# EAGLE board keyboard (EAGLE 9.6.1)
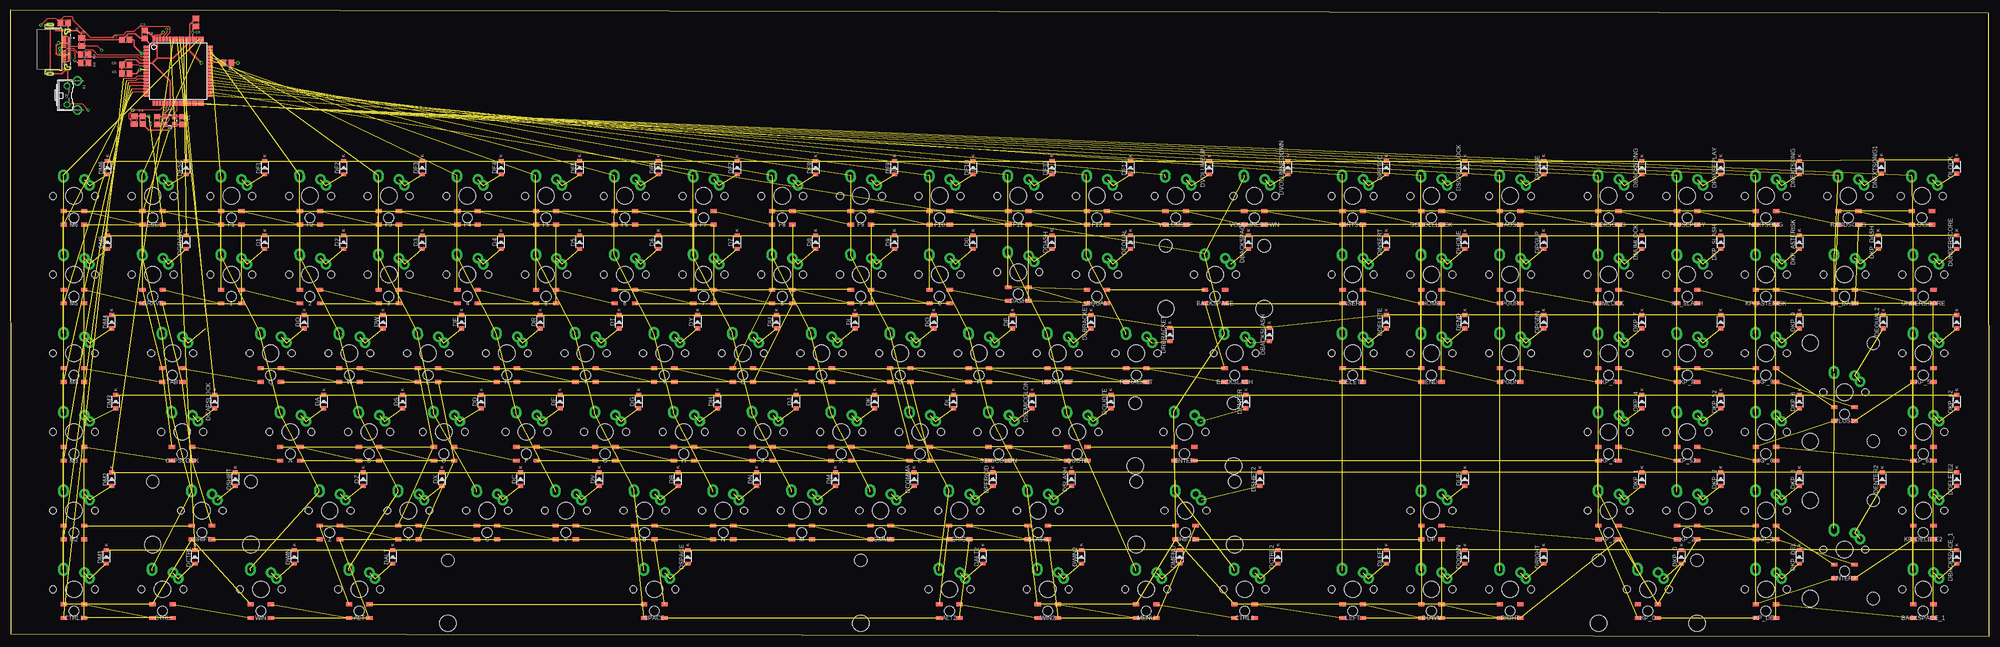
[diagram p6: board, top side]
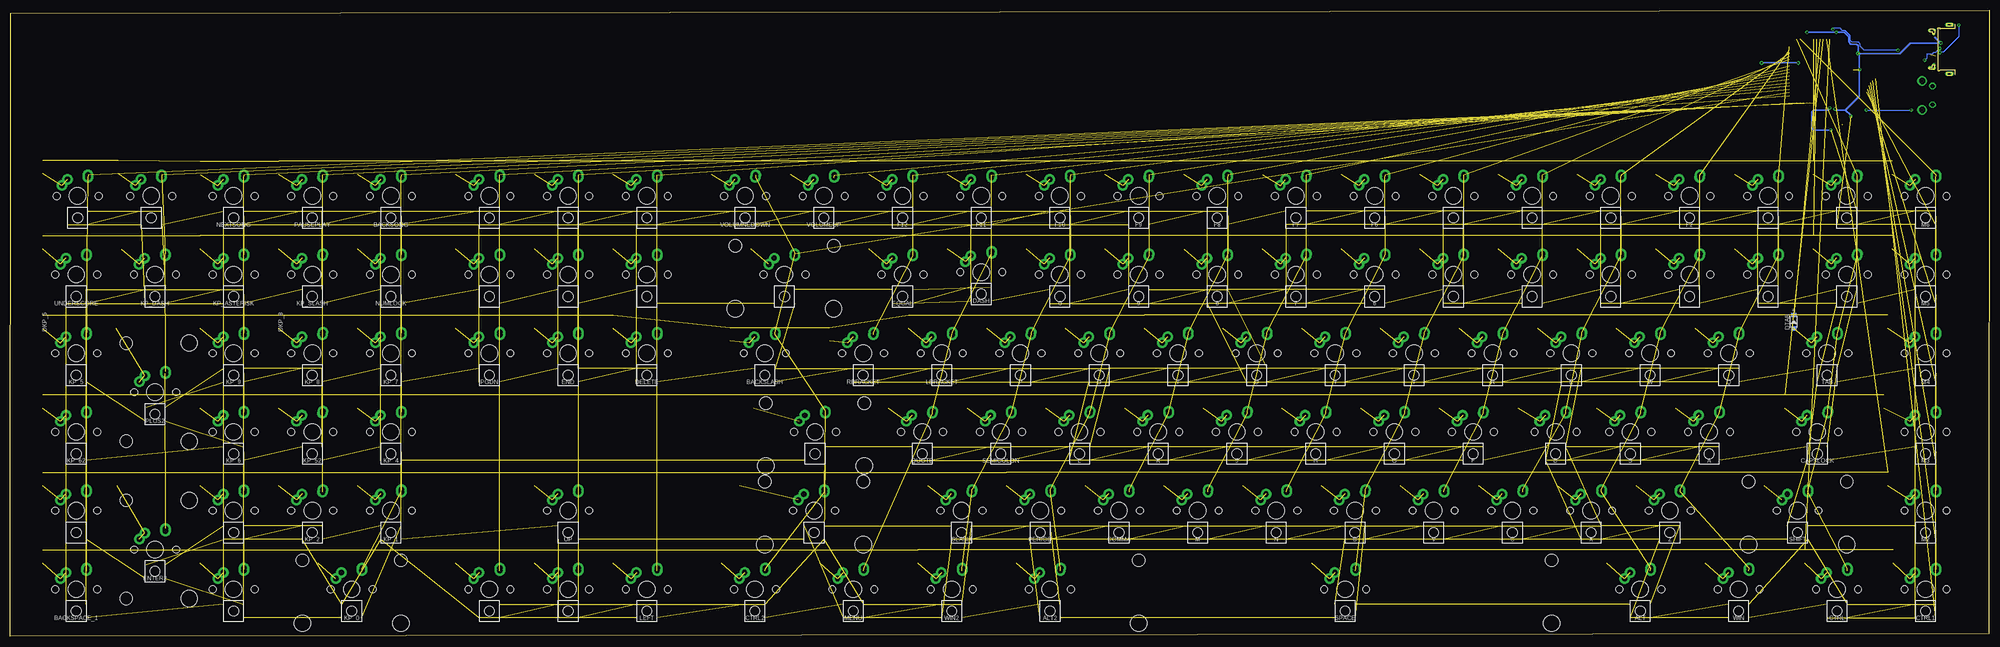
[diagram p7: board, bottom side, seen from below]

Size 479.03 x 151.66 mm. Coordinates in mm from the lower left corner, seen from the top.
Outline: 0.05,0.7 479.03,0 478.98,150.96 0,151.66 0.05,0.7
Copper layers (1+2*15+16): Top 0.035mm / dielectric 1.5mm / Route2 0.035mm / dielectric 0.15mm / Route15 0.035mm / dielectric 0.2mm / Bottom 0.035mm
Design rules "default *": minimum track width 6mil, minimum drill 0.35mm, track to track 6mil, track to pad 6mil, pad to pad 6mil, via to via 6mil, smd to smd 6mil, copper to edge 40mil, drill to drill 6mil, minimum pad ring 10mil, minimum via ring 8mil, stop-mask expansion 4mil, vias tented up to drill 0mil, thermal gap 10mil
Net classes: 0 default: width 0.2 mm; 1 POWER: width 0.406 mm

## Footprints (pad centres in the part's own frame; a part is rotated, then mirrored left to right if it is on the bottom)
ALPSMX-1U-SMDRGB = drill 1.3 pad 2.54: ALPS1 2.5,4; ALPS2 -2.5,4.5; MX1 3.81,2.54; MX2 -2.54,5.08 | smd 1.5 x 0.9: DIN -2.45,-6.95; DOUT 2.45,-3.65; VDD 2.45,-6.95; VSS -2.45,-3.65 | hole 4: 0,0 | hole 1.7: -5.08,0; 5.08,0 | hole 2.4: 0,-5.3
ALPSMX-2U-SMDRGB = drill 1.3 pad 2.54: ALPS1 2.5,4; ALPS2 -2.5,4.5; MX1 3.81,2.54; MX2 -2.54,5.08 | smd 1.5 x 0.9: DIN -2.45,-6.95; DOUT 2.45,-3.65; VDD 2.45,-6.95; VSS -2.45,-3.65 | hole 4: 0,0; -11.9,-8.24; 11.9,-8.24 | hole 1.7: -5.08,0; 5.08,0 | hole 3.05: -11.9,7; 11.9,7 | hole 2.4: 0,-5.3
C0805 = smd 1.3 x 1.5: 1 -0.95,0; 2 0.95,0
SOD-123 = smd 0.91 x 1.22: A -1.635,0; C 1.635,0
ALPSMX-2U-SMDRGB-ROTATED = drill 1.3 pad 2.54: ALPS1 2.5,4; ALPS2 -2.5,4.5; MX1 3.81,2.54; MX2 -2.54,5.08 | smd 1.5 x 0.9: DIN -2.45,-6.95; DOUT 2.45,-3.65; VDD 2.45,-6.95; VSS -2.45,-3.65 | hole 4: 0,0; -8.24,-11.9; -8.24,11.9 | hole 1.7: -5.08,0; 5.08,0 | hole 3.05: 7,-11.9; 7,11.9 | hole 2.4: 0,-5.3
TQFP64 = smd 1.194 x 0.559: 1 -7.76,5.905; 2 -7.76,5.118; 3 -7.76,4.331; 4 -7.76,3.543; 5 -7.76,2.756; 6 -7.76,1.968; 7 -7.76,1.181; 8 -7.76,0.394; 9 -7.76,-0.394; 10 -7.76,-1.181; 11 -7.76,-1.968; 12 -7.76,-2.756; 13 -7.76,-3.543; 14 -7.76,-4.331; 15 -7.76,-5.118; 16 -7.76,-5.905; 33 7.76,-5.905; 34 7.76,-5.118; 35 7.76,-4.331; 36 7.76,-3.543; 37 7.76,-2.756; 38 7.76,-1.968; 39 7.76,-1.181; 40 7.76,-0.394; 41 7.76,0.394; 42 7.76,1.181; 43 7.76,1.968; 44 7.76,2.756; 45 7.76,3.543; 46 7.76,4.331; 47 7.76,5.118; 48 7.76,5.905 | smd 0.559 x 1.194: 17 -5.905,-7.76; 18 -5.118,-7.76; 19 -4.331,-7.76; 20 -3.543,-7.76; 21 -2.756,-7.76; 22 -1.968,-7.76; 23 -1.181,-7.76; 24 -0.394,-7.76; 25 0.394,-7.76; 26 1.181,-7.76; 27 1.968,-7.76; 28 2.756,-7.76; 29 3.543,-7.76; 30 4.331,-7.76; 31 5.118,-7.76; 32 5.905,-7.76; 49 5.905,7.76; 50 5.118,7.76; 51 4.331,7.76; 52 3.543,7.76; 53 2.756,7.76; 54 1.968,7.76; 55 1.181,7.76; 56 0.394,7.76; 57 -0.394,7.76; 58 -1.181,7.76; 59 -1.968,7.76; 60 -2.756,7.76; 61 -3.543,7.76; 62 -4.331,7.76; 63 -5.118,7.76; 64 -5.905,7.76
TE_1-2295018-2 = smd 0.3 x 0.8: A1 -2.75,4.63; A2 -2.25,4.63; A3 -1.75,4.63; A4 -1.25,4.63; A5 -0.75,4.63; A6 -0.25,4.63; A7 0.25,4.63; A8 0.75,4.63; A9 1.25,4.63; A10 1.75,4.63; A11 2.25,4.63; A12 2.75,4.63; B1 3,3.43; B2 2.5,3.43; B3 2,3.43; B4 1.5,3.43; B5 1,3.43; B6 0.5,3.43; B7 -0.5,3.43; B8 -1,3.43; B9 -1.5,3.43; B10 -2,3.43; B11 -2.5,3.43; B12 -3,3.43 | drill 0.5 long: P1_1 -4.55,4.22; P2_1 4.55,4.22 | drill 0.35 long: P1_2 -4.191,3.795; P2_2 4.191,3.795 | drill 0.5 pad 1.1 long: P4 -5.97,0; P5 5.97,0
M0805 = smd 1.3 x 1.6: 1 -0.95,0; 2 0.95,0
B3F-31XX = drill 1.016 octagon: 1 -2.261,-1.245; 2 2.261,-1.245 | drill 1.499 pad 2.159: 3 -3.505,1.245; 4 3.505,1.245
ALPSMX-6.25U-SMDRGB = drill 1.3 pad 2.54: ALPS1 2.5,4; ALPS2 -2.5,4.5; MX1 3.81,2.54; MX2 -2.54,5.08 | smd 1.5 x 0.9: DIN -2.45,-6.95; DOUT 2.45,-3.65; VDD 2.45,-6.95; VSS -2.45,-3.65 | hole 4: 0,0; -50,-8.24; 50,-8.24 | hole 1.7: -5.08,0; 5.08,0 | hole 3.05: -50,7; 50,7 | hole 2.4: 0,-5.3
CRYSTAL-SMD-3.2X2.5MM = smd 1.2 x 1.1: 1 -1.175,-0.875; 2 1.175,-0.875; 3 1.175,0.875; 4 -1.175,0.875

## Placement (x,y rotation side)
0  KEYSWITCH-RGBSMDLED-ALPSMX-1U-SMDRGB  [ALPSMX-1U-SMDRGB]  224.95,87.65 0 top
1  KEYSWITCH-RGBSMDLED-ALPSMX-1U-SMDRGB  [ALPSMX-1U-SMDRGB]  53.5,87.65 0 top
2  KEYSWITCH-RGBSMDLED-ALPSMX-1U-SMDRGB  [ALPSMX-1U-SMDRGB]  72.55,87.65 0 top
3  KEYSWITCH-RGBSMDLED-ALPSMX-1U-SMDRGB  [ALPSMX-1U-SMDRGB]  91.6,87.65 0 top
4  KEYSWITCH-RGBSMDLED-ALPSMX-1U-SMDRGB  [ALPSMX-1U-SMDRGB]  110.65,87.65 0 top
5  KEYSWITCH-RGBSMDLED-ALPSMX-1U-SMDRGB  [ALPSMX-1U-SMDRGB]  129.7,87.65 0 top
6  KEYSWITCH-RGBSMDLED-ALPSMX-1U-SMDRGB  [ALPSMX-1U-SMDRGB]  148.75,87.65 0 top
7  KEYSWITCH-RGBSMDLED-ALPSMX-1U-SMDRGB  [ALPSMX-1U-SMDRGB]  167.8,87.65 0 top
8  KEYSWITCH-RGBSMDLED-ALPSMX-1U-SMDRGB  [ALPSMX-1U-SMDRGB]  186.85,87.65 0 top
9  KEYSWITCH-RGBSMDLED-ALPSMX-1U-SMDRGB  [ALPSMX-1U-SMDRGB]  205.9,87.65 0 top
A  KEYSWITCH-RGBSMDLED-ALPSMX-1U-SMDRGB  [ALPSMX-1U-SMDRGB]  67.79,49.55 0 top
ALT  KEYSWITCH-RGBSMDLED-ALPSMX-1U-SMDRGB  [ALPSMX-1U-SMDRGB]  84.46,11.45 0 top
ALT2  KEYSWITCH-RGBSMDLED-ALPSMX-1U-SMDRGB  [ALPSMX-1U-SMDRGB]  227.33,11.45 0 top
B  KEYSWITCH-RGBSMDLED-ALPSMX-1U-SMDRGB  [ALPSMX-1U-SMDRGB]  153.51,30.5 0 top
BACKSLASH  KEYSWITCH-RGBSMDLED-ALPSMX-1U-SMDRGB  [ALPSMX-1U-SMDRGB]  296.39,68.6 0 top
BACKSONG  KEYSWITCH-RGBSMDLED-ALPSMX-1U-SMDRGB  [ALPSMX-1U-SMDRGB]  386.88,106.7 0 top
BACKSPACE  KEYSWITCH-RGBSMDLED-ALPSMX-2U-SMDRGB  [ALPSMX-2U-SMDRGB]  291.63,87.65 0 top
BACKSPACE_1  KEYSWITCH-RGBSMDLED-ALPSMX-1U-SMDRGB  [ALPSMX-1U-SMDRGB]  463.08,11.45 0 top
C  KEYSWITCH-RGBSMDLED-ALPSMX-1U-SMDRGB  [ALPSMX-1U-SMDRGB]  115.41,30.5 0 top
C1  22pF  [C0805]  41.65,124.95 270 top
C2  22pF  [C0805]  35.55,124.95 90 top
C3  0.1uF  [C0805]  32.51,145.81 270 top
C4  0.1uF  [C0805]  32.02,125.06 270 top
C5  0.1uF  [C0805]  27.93,136.36 180 top
C6  0.1uF  [C0805]  44.93,148.73 90 top
C7  0.1uF  [C0805]  27.93,144.51 180 top
C8  1u  [C0805]  27.93,138.42 0 top
CAPSLOCK  KEYSWITCH-RGBSMDLED-ALPSMX-1U-SMDRGB  [ALPSMX-1U-SMDRGB]  41.59,49.55 0 top
COMMA  KEYSWITCH-RGBSMDLED-ALPSMX-1U-SMDRGB  [ALPSMX-1U-SMDRGB]  210.66,30.5 0 top
CTRL  KEYSWITCH-RGBSMDLED-ALPSMX-1U-SMDRGB  [ALPSMX-1U-SMDRGB]  36.83,11.45 0 top
CTRL1  KEYSWITCH-RGBSMDLED-ALPSMX-1U-SMDRGB  [ALPSMX-1U-SMDRGB]  15.4,11.45 0 top
CTRL2  KEYSWITCH-RGBSMDLED-ALPSMX-1U-SMDRGB  [ALPSMX-1U-SMDRGB]  298.77,11.45 0 top
D  KEYSWITCH-RGBSMDLED-ALPSMX-1U-SMDRGB  [ALPSMX-1U-SMDRGB]  104.97,49.55 0 top
D0  [SOD-123]  233.06,95.5 90 top
D1  [SOD-123]  61.61,95.5 90 top
D2  [SOD-123]  80.66,95.5 90 top
D3  [SOD-123]  99.71,95.5 90 top
D4  [SOD-123]  118.76,95.5 90 top
D5  [SOD-123]  137.81,95.5 90 top
D6  [SOD-123]  156.86,95.5 90 top
D7  [SOD-123]  175.91,95.5 90 top
D8  [SOD-123]  194.96,95.5 90 top
D9  [SOD-123]  214.01,95.5 90 top
DA  [SOD-123]  75.9,56.9 90 top
DALT  [SOD-123]  92.57,19.3 90 top
DALT2  [SOD-123]  235.44,19.3 90 top
DASH  KEYSWITCH-RGBSMDLED-ALPSMX-1U-SMDRGB  [ALPSMX-1U-SMDRGB]  244,88.25 0 top
DB  [SOD-123]  161.62,38.1 90 top
DBACKSLASH  [SOD-123]  304.76,73.15 90 top
DBACKSONG  [SOD-123]  394.99,113.54 90 top
DBACKSPACE  [SOD-123]  299.74,95.5 90 top
DBACKSPACE_1  [SOD-123]  471.19,19.3 90 top
DC  [SOD-123]  123.52,38.1 90 top
DCAPSLOCK  [SOD-123]  49.45,56.9 90 top
DCOMMA  [SOD-123]  218.77,38.1 90 top
DCTRL  [SOD-123]  44.69,19.3 90 top
DCTRL2  [SOD-123]  306.88,19.3 90 top
DD  [SOD-123]  114,56.9 90 top
DDASH  [SOD-123]  252.11,95.5 90 top
DDELETE  [SOD-123]  333.07,76.2 90 top
DDELETE2  [SOD-123]  471.19,38.1 90 top
DDOWN  [SOD-123]  352.12,19.3 90 top
DE  [SOD-123]  109.24,76.2 90 top
DELETE  KEYSWITCH-RGBSMDLED-ALPSMX-1U-SMDRGB  [ALPSMX-1U-SMDRGB]  324.96,68.6 0 top
DEND  [SOD-123]  352.12,76.2 90 top
DENTER  [SOD-123]  299.13,56.9 90 top
DENTER2  [SOD-123]  453.16,38.1 90 top
DEQUAL  [SOD-123]  271.16,95.5 90 top
DEQUAL2  [SOD-123]  453.41,76.2 90 top
DESC  [SOD-123]  42.56,113.54 90 top
DF  [SOD-123]  133.05,56.9 90 top
DF1  [SOD-123]  61.61,113.54 90 top
DF2  [SOD-123]  80.66,113.54 90 top
DF3  [SOD-123]  99.71,113.54 90 top
DF4  [SOD-123]  118.76,113.54 90 top
DF5  [SOD-123]  137.81,113.54 90 top
DF6  [SOD-123]  156.86,113.54 90 top
DF7  [SOD-123]  175.91,113.54 90 top
DF8  [SOD-123]  194.96,113.54 90 top
DF9  [SOD-123]  214.01,113.54 90 top
DF10  [SOD-123]  233.06,113.54 90 top
DF11  [SOD-123]  252.11,113.54 90 top
DF12  [SOD-123]  271.16,113.54 90 top
DG  [SOD-123]  152.1,56.9 90 top
DGRAVE  [SOD-123]  42.56,95.5 90 top
DH  [SOD-123]  171.15,56.9 90 top
DHOME  [SOD-123]  352.12,95.5 90 top
DI  [SOD-123]  204.49,76.2 90 top
DINSERT  [SOD-123]  333.07,95.5 90 top
DJ  [SOD-123]  190.2,56.9 90 top
DK  [SOD-123]  209.25,56.9 90 top
DKP_0  [SOD-123]  404.51,19.3 90 top
DKP_1  [SOD-123]  394.99,38.1 90 top
DKP_2  [SOD-123]  414.04,38.1 90 top
DKP_3  [SOD-123]  433.09,38.1 90 top
DKP_4  [SOD-123]  394.99,56.9 90 top
DKP_5  [SOD-123]  471.19,76.2 90 top
DKP_6  [SOD-123]  433.09,56.9 90 top
DKP_7  [SOD-123]  394.99,76.2 90 top
DKP_8  [SOD-123]  414.04,76.2 90 top
DKP_9  [SOD-123]  433.09,76.2 90 top
DKP_52  [SOD-123]  414.04,56.9 90 top
DKP_62  [SOD-123]  471.19,56.9 90 top
DKP_ASTERISK  [SOD-123]  433.09,95.5 90 top
DKP_DASH  [SOD-123]  452.14,95.5 90 top
DKP_DEL  [SOD-123]  433.09,19.3 90 top
DKP_SLASH  [SOD-123]  414.04,95.5 90 top
DL  [SOD-123]  228.3,56.9 90 top
DLBRACKET  [SOD-123]  261.64,76.2 90 top
DLEFT  [SOD-123]  333.07,19.3 90 top
DLOCK  [SOD-123]  471.19,113.75 90 top
DM  [SOD-123]  199.72,38.1 90 top
DM1  [SOD-123]  23.26,19.3 90 top
DM2  [SOD-123]  24.51,38.1 90 top
DM3  [SOD-123]  25.51,56.9 90 top
DM4  [SOD-123]  24.51,76.2 90 top
DM5  [SOD-123]  23.51,95.5 90 top
DM6  [SOD-123]  23.51,113.54 90 top
DMENU  [SOD-123]  283.07,19.3 90 top
DN  [SOD-123]  180.67,38.1 90 top
DNEXTSONG  [SOD-123]  433.09,113.54 90 top
DNEXTSONG1  [SOD-123]  452.93,113.75 90 top
DNUMLOCK  [SOD-123]  394.99,95.5 90 top
DO  [SOD-123]  223.54,76.2 90 top
DOWN  KEYSWITCH-RGBSMDLED-ALPSMX-1U-SMDRGB  [ALPSMX-1U-SMDRGB]  344.01,11.45 0 top
DP  [SOD-123]  242.59,76.2 90 top
DPAUSE  [SOD-123]  371.17,113.54 90 top
DPAUSEPLAY  [SOD-123]  414.04,113.54 90 top
DPERIOD  [SOD-123]  237.82,38.1 90 top
DPGDN  [SOD-123]  371.17,76.2 90 top
DPGUP  [SOD-123]  371.17,95.5 90 top
DPRTSC  [SOD-123]  333.07,113.54 90 top
DQ  [SOD-123]  71.14,76.2 90 top
DQUOTE  [SOD-123]  266.4,56.9 90 top
DR  [SOD-123]  128.29,76.2 90 top
DRBRACKET  [SOD-123]  280.69,73.15 90 top
DRIGHT  [SOD-123]  371.17,19.3 90 top
DS  [SOD-123]  94.95,56.9 90 top
DSCROLLLOCK  [SOD-123]  352.12,113.54 90 top
DSEMICOLON  [SOD-123]  247.35,56.9 90 top
DSHIFT  [SOD-123]  54.47,38.1 90 top
DSHIFT2  [SOD-123]  302.5,38.1 90 top
DSLASH  [SOD-123]  256.87,38.1 90 top
DSPACE  [SOD-123]  164,19.3 90 top
DT  [SOD-123]  147.34,76.2 90 top
DTAB  [SOD-123]  47.32,76.2 90 bottom
DU  [SOD-123]  185.44,76.2 90 top
DUNDERSCORE  [SOD-123]  471.19,95.5 90 top
DUP  [SOD-123]  352.12,38.1 90 top
DV  [SOD-123]  142.57,38.1 90 top
DVOLUMEUP  [SOD-123]  290.21,113.54 90 top
DVOLUMNEDOWN  [SOD-123]  309.26,113.54 90 top
DW  [SOD-123]  90.19,76.2 90 top
DWIN  [SOD-123]  68.75,19.3 90 top
DWIN2  [SOD-123]  259.25,19.3 90 top
DX  [SOD-123]  104.47,38.1 90 top
DY  [SOD-123]  166.39,76.2 90 top
DZ  [SOD-123]  85.42,38.1 90 top
E  KEYSWITCH-RGBSMDLED-ALPSMX-1U-SMDRGB  [ALPSMX-1U-SMDRGB]  101.13,68.6 0 top
END  KEYSWITCH-RGBSMDLED-ALPSMX-1U-SMDRGB  [ALPSMX-1U-SMDRGB]  344.01,68.6 0 top
ENTER  KEYSWITCH-RGBSMDLED-ALPSMX-2U-SMDRGB  [ALPSMX-2U-SMDRGB]  284.23,49.55 0 top
ENTER2  KEYSWITCH-RGBSMDLED-ALPSMX-2U-SMDRGB-ROTATED  [ALPSMX-2U-SMDRGB-ROTATED]  443.99,21.07 0 top
EQUAL  KEYSWITCH-RGBSMDLED-ALPSMX-1U-SMDRGB  [ALPSMX-1U-SMDRGB]  263.05,87.65 0 top
ESC  KEYSWITCH-RGBSMDLED-ALPSMX-1U-SMDRGB  [ALPSMX-1U-SMDRGB]  34.45,106.7 0 top
F  KEYSWITCH-RGBSMDLED-ALPSMX-1U-SMDRGB  [ALPSMX-1U-SMDRGB]  124.94,49.55 0 top
F1  KEYSWITCH-RGBSMDLED-ALPSMX-1U-SMDRGB  [ALPSMX-1U-SMDRGB]  53.5,106.7 0 top
F2  KEYSWITCH-RGBSMDLED-ALPSMX-1U-SMDRGB  [ALPSMX-1U-SMDRGB]  72.55,106.7 0 top
F3  KEYSWITCH-RGBSMDLED-ALPSMX-1U-SMDRGB  [ALPSMX-1U-SMDRGB]  91.6,106.7 0 top
F4  KEYSWITCH-RGBSMDLED-ALPSMX-1U-SMDRGB  [ALPSMX-1U-SMDRGB]  110.65,106.7 0 top
F5  KEYSWITCH-RGBSMDLED-ALPSMX-1U-SMDRGB  [ALPSMX-1U-SMDRGB]  129.7,106.7 0 top
F6  KEYSWITCH-RGBSMDLED-ALPSMX-1U-SMDRGB  [ALPSMX-1U-SMDRGB]  148.75,106.7 0 top
F7  KEYSWITCH-RGBSMDLED-ALPSMX-1U-SMDRGB  [ALPSMX-1U-SMDRGB]  167.8,106.7 0 top
F8  KEYSWITCH-RGBSMDLED-ALPSMX-1U-SMDRGB  [ALPSMX-1U-SMDRGB]  186.85,106.7 0 top
F9  KEYSWITCH-RGBSMDLED-ALPSMX-1U-SMDRGB  [ALPSMX-1U-SMDRGB]  205.9,106.7 0 top
F10  KEYSWITCH-RGBSMDLED-ALPSMX-1U-SMDRGB  [ALPSMX-1U-SMDRGB]  224.95,106.7 0 top
F11  KEYSWITCH-RGBSMDLED-ALPSMX-1U-SMDRGB  [ALPSMX-1U-SMDRGB]  244,106.7 0 top
F12  KEYSWITCH-RGBSMDLED-ALPSMX-1U-SMDRGB  [ALPSMX-1U-SMDRGB]  263.05,106.7 0 top
G  KEYSWITCH-RGBSMDLED-ALPSMX-1U-SMDRGB  [ALPSMX-1U-SMDRGB]  143.99,49.55 0 top
GRAVE  KEYSWITCH-RGBSMDLED-ALPSMX-1U-SMDRGB  [ALPSMX-1U-SMDRGB]  34.45,87.65 0 top
H  KEYSWITCH-RGBSMDLED-ALPSMX-1U-SMDRGB  [ALPSMX-1U-SMDRGB]  163.04,49.55 0 top
HOME  KEYSWITCH-RGBSMDLED-ALPSMX-1U-SMDRGB  [ALPSMX-1U-SMDRGB]  344.01,87.65 0 top
I  KEYSWITCH-RGBSMDLED-ALPSMX-1U-SMDRGB  [ALPSMX-1U-SMDRGB]  196.38,68.6 0 top
IC3  [TQFP64]  40.63,136.89 0 top
INSERT  KEYSWITCH-RGBSMDLED-ALPSMX-1U-SMDRGB  [ALPSMX-1U-SMDRGB]  324.96,87.65 0 top
J  KEYSWITCH-RGBSMDLED-ALPSMX-1U-SMDRGB  [ALPSMX-1U-SMDRGB]  182.09,49.55 0 top
J1  1-2295018-2  [TE_1-2295018-2]  9.65,142.23 270 top
K  KEYSWITCH-RGBSMDLED-ALPSMX-1U-SMDRGB  [ALPSMX-1U-SMDRGB]  201.14,49.55 0 top
KP_0  KEYSWITCH-RGBSMDLED-ALPSMX-2U-SMDRGB  [ALPSMX-2U-SMDRGB]  396.4,11.45 0 top
KP_1  KEYSWITCH-RGBSMDLED-ALPSMX-1U-SMDRGB  [ALPSMX-1U-SMDRGB]  386.88,30.5 0 top
KP_2  KEYSWITCH-RGBSMDLED-ALPSMX-1U-SMDRGB  [ALPSMX-1U-SMDRGB]  405.93,30.5 0 top
KP_3  KEYSWITCH-RGBSMDLED-ALPSMX-1U-SMDRGB  [ALPSMX-1U-SMDRGB]  424.98,30.5 0 top
KP_4  KEYSWITCH-RGBSMDLED-ALPSMX-1U-SMDRGB  [ALPSMX-1U-SMDRGB]  386.88,49.55 0 top
KP_5  KEYSWITCH-RGBSMDLED-ALPSMX-1U-SMDRGB  [ALPSMX-1U-SMDRGB]  463.08,68.6 0 top
KP_6  KEYSWITCH-RGBSMDLED-ALPSMX-1U-SMDRGB  [ALPSMX-1U-SMDRGB]  424.98,49.55 0 top
KP_7  KEYSWITCH-RGBSMDLED-ALPSMX-1U-SMDRGB  [ALPSMX-1U-SMDRGB]  386.88,68.6 0 top
KP_8  KEYSWITCH-RGBSMDLED-ALPSMX-1U-SMDRGB  [ALPSMX-1U-SMDRGB]  405.93,68.6 0 top
KP_9  KEYSWITCH-RGBSMDLED-ALPSMX-1U-SMDRGB  [ALPSMX-1U-SMDRGB]  424.98,68.6 0 top
KP_52  KEYSWITCH-RGBSMDLED-ALPSMX-1U-SMDRGB  [ALPSMX-1U-SMDRGB]  405.93,49.55 0 top
KP_62  KEYSWITCH-RGBSMDLED-ALPSMX-1U-SMDRGB  [ALPSMX-1U-SMDRGB]  463.08,49.55 0 top
KP_ASTERISK  KEYSWITCH-RGBSMDLED-ALPSMX-1U-SMDRGB  [ALPSMX-1U-SMDRGB]  424.98,87.65 0 top
KP_DASH  KEYSWITCH-RGBSMDLED-ALPSMX-1U-SMDRGB  [ALPSMX-1U-SMDRGB]  444.03,87.65 0 top
KP_DEL  KEYSWITCH-RGBSMDLED-ALPSMX-1U-SMDRGB  [ALPSMX-1U-SMDRGB]  424.98,11.45 0 top
KP_DELETE2  KEYSWITCH-RGBSMDLED-ALPSMX-1U-SMDRGB  [ALPSMX-1U-SMDRGB]  463.08,30.5 0 top
KP_SLASH  KEYSWITCH-RGBSMDLED-ALPSMX-1U-SMDRGB  [ALPSMX-1U-SMDRGB]  405.93,87.65 0 top
L  KEYSWITCH-RGBSMDLED-ALPSMX-1U-SMDRGB  [ALPSMX-1U-SMDRGB]  220.19,49.55 0 top
LBRACKET  KEYSWITCH-RGBSMDLED-ALPSMX-1U-SMDRGB  [ALPSMX-1U-SMDRGB]  253.53,68.6 0 top
LEFT  KEYSWITCH-RGBSMDLED-ALPSMX-1U-SMDRGB  [ALPSMX-1U-SMDRGB]  324.96,11.45 0 top
LOCK  KEYSWITCH-RGBSMDLED-ALPSMX-1U-SMDRGB  [ALPSMX-1U-SMDRGB]  462.73,106.7 0 top
M  KEYSWITCH-RGBSMDLED-ALPSMX-1U-SMDRGB  [ALPSMX-1U-SMDRGB]  191.61,30.5 0 top
M2  KEYSWITCH-RGBSMDLED-ALPSMX-1U-SMDRGB  [ALPSMX-1U-SMDRGB]  15.4,30.5 0 top
M3  KEYSWITCH-RGBSMDLED-ALPSMX-1U-SMDRGB  [ALPSMX-1U-SMDRGB]  15.4,49.55 0 top
M4  KEYSWITCH-RGBSMDLED-ALPSMX-1U-SMDRGB  [ALPSMX-1U-SMDRGB]  15.4,68.6 0 top
M5  KEYSWITCH-RGBSMDLED-ALPSMX-1U-SMDRGB  [ALPSMX-1U-SMDRGB]  15.4,87.65 0 top
M6  KEYSWITCH-RGBSMDLED-ALPSMX-1U-SMDRGB  [ALPSMX-1U-SMDRGB]  15.4,106.7 0 top
MENU  KEYSWITCH-RGBSMDLED-ALPSMX-1U-SMDRGB  [ALPSMX-1U-SMDRGB]  274.96,11.45 0 top
N  KEYSWITCH-RGBSMDLED-ALPSMX-1U-SMDRGB  [ALPSMX-1U-SMDRGB]  172.56,30.5 0 top
NEXTSONG  KEYSWITCH-RGBSMDLED-ALPSMX-1U-SMDRGB  [ALPSMX-1U-SMDRGB]  424.98,106.7 0 top
NUMLOCK  KEYSWITCH-RGBSMDLED-ALPSMX-1U-SMDRGB  [ALPSMX-1U-SMDRGB]  386.88,87.65 0 top
O  KEYSWITCH-RGBSMDLED-ALPSMX-1U-SMDRGB  [ALPSMX-1U-SMDRGB]  215.43,68.6 0 top
P  KEYSWITCH-RGBSMDLED-ALPSMX-1U-SMDRGB  [ALPSMX-1U-SMDRGB]  234.48,68.6 0 top
PAUSE  KEYSWITCH-RGBSMDLED-ALPSMX-1U-SMDRGB  [ALPSMX-1U-SMDRGB]  363.06,106.7 0 top
PAUSEPLAY  KEYSWITCH-RGBSMDLED-ALPSMX-1U-SMDRGB  [ALPSMX-1U-SMDRGB]  405.93,106.7 0 top
PERIOD  KEYSWITCH-RGBSMDLED-ALPSMX-1U-SMDRGB  [ALPSMX-1U-SMDRGB]  229.71,30.5 0 top
PGDN  KEYSWITCH-RGBSMDLED-ALPSMX-1U-SMDRGB  [ALPSMX-1U-SMDRGB]  363.06,68.6 0 top
PGUP  KEYSWITCH-RGBSMDLED-ALPSMX-1U-SMDRGB  [ALPSMX-1U-SMDRGB]  363.06,87.65 0 top
PLUS2  KEYSWITCH-RGBSMDLED-ALPSMX-2U-SMDRGB-ROTATED  [ALPSMX-2U-SMDRGB-ROTATED]  443.99,59.17 0 top
PRTSC  KEYSWITCH-RGBSMDLED-ALPSMX-1U-SMDRGB  [ALPSMX-1U-SMDRGB]  324.96,106.7 0 top
Q  KEYSWITCH-RGBSMDLED-ALPSMX-1U-SMDRGB  [ALPSMX-1U-SMDRGB]  63.03,68.6 0 top
QUOTE  KEYSWITCH-RGBSMDLED-ALPSMX-1U-SMDRGB  [ALPSMX-1U-SMDRGB]  258.29,49.55 0 top
R  KEYSWITCH-RGBSMDLED-ALPSMX-1U-SMDRGB  [ALPSMX-1U-SMDRGB]  120.18,68.6 0 top
R1  10k  [M0805]  29.99,125.06 270 top
R2  10k  [M0805]  52.57,138.92 180 top
R3  22  [M0805]  17.98,140.96 0 top
R4  22  [M0805]  17.98,138.92 0 top
R5  5.1k  [M0805]  17.29,143.98 90 top
R6  5.1k  [M0805]  13.05,148.58 180 top
RANDSONG  KEYSWITCH-RGBSMDLED-ALPSMX-1U-SMDRGB  [ALPSMX-1U-SMDRGB]  444.93,106.7 0 top
RBRACKET  KEYSWITCH-RGBSMDLED-ALPSMX-1U-SMDRGB  [ALPSMX-1U-SMDRGB]  272.58,68.6 0 top
RIGHT  KEYSWITCH-RGBSMDLED-ALPSMX-1U-SMDRGB  [ALPSMX-1U-SMDRGB]  363.06,11.45 0 top
S  KEYSWITCH-RGBSMDLED-ALPSMX-1U-SMDRGB  [ALPSMX-1U-SMDRGB]  86.84,49.55 0 top
S1  [B3F-31XX]  14.98,131.05 270 top
SCROLLLOCK  KEYSWITCH-RGBSMDLED-ALPSMX-1U-SMDRGB  [ALPSMX-1U-SMDRGB]  344.01,106.7 0 top
SEMICOLON  KEYSWITCH-RGBSMDLED-ALPSMX-1U-SMDRGB  [ALPSMX-1U-SMDRGB]  239.24,49.55 0 top
SHIFT  KEYSWITCH-RGBSMDLED-ALPSMX-2U-SMDRGB  [ALPSMX-2U-SMDRGB]  46.36,30.5 0 top
SHIFT2  KEYSWITCH-RGBSMDLED-ALPSMX-2U-SMDRGB  [ALPSMX-2U-SMDRGB]  284.48,30.5 0 top
SLASH  KEYSWITCH-RGBSMDLED-ALPSMX-1U-SMDRGB  [ALPSMX-1U-SMDRGB]  248.76,30.5 0 top
SPACE  KEYSWITCH-RGBSMDLED-ALPSMX-6.25U-SMDRGB  [ALPSMX-6.25U-SMDRGB]  155.89,11.45 0 top
T  KEYSWITCH-RGBSMDLED-ALPSMX-1U-SMDRGB  [ALPSMX-1U-SMDRGB]  139.23,68.6 0 top
TAB  KEYSWITCH-RGBSMDLED-ALPSMX-1U-SMDRGB  [ALPSMX-1U-SMDRGB]  39.21,68.6 0 top
U  KEYSWITCH-RGBSMDLED-ALPSMX-1U-SMDRGB  [ALPSMX-1U-SMDRGB]  177.33,68.6 0 top
UNDERSCORE  KEYSWITCH-RGBSMDLED-ALPSMX-1U-SMDRGB  [ALPSMX-1U-SMDRGB]  463.08,87.65 0 top
UP  KEYSWITCH-RGBSMDLED-ALPSMX-1U-SMDRGB  [ALPSMX-1U-SMDRGB]  344.01,30.5 0 top
V  KEYSWITCH-RGBSMDLED-ALPSMX-1U-SMDRGB  [ALPSMX-1U-SMDRGB]  134.46,30.5 0 top
VOLUMEUP  KEYSWITCH-RGBSMDLED-ALPSMX-1U-SMDRGB  [ALPSMX-1U-SMDRGB]  282.1,106.7 0 top
VOLUMNEDOWN  KEYSWITCH-RGBSMDLED-ALPSMX-1U-SMDRGB  [ALPSMX-1U-SMDRGB]  301.15,106.7 0 top
W  KEYSWITCH-RGBSMDLED-ALPSMX-1U-SMDRGB  [ALPSMX-1U-SMDRGB]  82.08,68.6 0 top
WIN  KEYSWITCH-RGBSMDLED-ALPSMX-1U-SMDRGB  [ALPSMX-1U-SMDRGB]  60.64,11.45 0 top
WIN2  KEYSWITCH-RGBSMDLED-ALPSMX-1U-SMDRGB  [ALPSMX-1U-SMDRGB]  251.14,11.45 0 top
X  KEYSWITCH-RGBSMDLED-ALPSMX-1U-SMDRGB  [ALPSMX-1U-SMDRGB]  96.36,30.5 0 top
Y  KEYSWITCH-RGBSMDLED-ALPSMX-1U-SMDRGB  [ALPSMX-1U-SMDRGB]  158.28,68.6 0 top
Y2  CRYSTAL-GROUNDEDSMD-3.2X2.5  [CRYSTAL-SMD-3.2X2.5MM]  38.6,124.95 180 top
Z  KEYSWITCH-RGBSMDLED-ALPSMX-1U-SMDRGB  [ALPSMX-1U-SMDRGB]  77.31,30.5 0 top

## Tracks (layer width: path | path; a pad name or v marks a point on that pad's centre or on a via)
+5V  (via drill 0.35)  (118 unrouted)
  Top 0.2: J1.A4 14.18,143.57 13.77,143.57 13.62,143.73 J1.B9
  Top 0.305: v11.68,143.75 11.7,143.72 J1.B9 | J1.B4 12.52,140.73
  Top 0.406: v37,146.31 36.3,145.62 | 36.3,145.62 IC3.62 | 36.3,145.62 36.29,145.6 35.07,145.6 34.69,145.22 | 34.69,145.22 34.69,144.69 IC3.64 | 34.69,145.22 34.59,145.22 33.06,146.76 C3.1 | IC3.21 37.84,129.09 37.84,128.26 v37.33,127.75 | 32.89,141.21 IC3.3 31.76,141.22 v31.74,141.21 | C7.1 29.71,144.51 29.97,144.26 29.97,142.99 31.73,141.22 | IC3.8 31.38,137.29 30.45,136.36 C5.1 | v33.52,125.97 32.06,125.97 C4.1 R1.1 | C6.1 44.18,147.03 44.18,146.26 v44.12,146.31 44.12,144.7 IC3.52 | v11.68,143.75 11.17,143.24 11.17,141.19 11.63,140.73 12.52,140.73
  Bottom 0.406: 11.7,143.72 v11.68,143.75 | v37.33,127.75 37.08,127.49 34.79,127.49 | v33.52,125.97 33.52,126.22 34.79,127.49 | v44.12,146.31 v37,146.31 35.07,146.31 34.03,145.27 34.03,144 33.45,143.42 32.13,143.42 31.74,143.04 v31.74,141.21 | v31.74,141.21 31.39,140.85 v31.39,137.3 | v31.39,137.3 31.39,137.25 | v31.39,137.3 31.39,130.9 34.79,127.49 | v11.68,143.75 13.13,145.2 | v31.74,141.21 21.58,141.21 19.04,143.75 v11.68,143.75
CC1  (via drill 0.35)
  Top 0.2: J1.A5 17.3,142.98 R5.1 21.04,143.03 v22.09,141.97 | IC3.61 37.09,145.51 37.84,146.26 v37.84,147.05
  Bottom 0.2: v22.09,141.97 30.22,141.97 31.24,142.99 31.24,143.5 31.62,143.87 33.14,143.87 33.57,144.31 33.57,145.46 34.88,146.77 35.53,146.77 36.06,147.31 37.59,147.31 v37.84,147.05
CC2  (via drill 0.35)
  Top 0.2: J1.B5 12.17,141.23 v11.93,141.46 | IC3.60 37.84,144.69 37.84,145.53 38.6,146.29 38.6,147.56 38.3,147.86 31.29,147.86 29.97,146.54 28.19,146.54 27.43,145.78 25.39,145.78 24.63,145.02 19.44,145.02 15.23,149.22 15.23,149.85 14.98,150.1 12.95,150.1 12.1,149.25 R6.2 11.08,149.59 8.88,149.59 v7.36,148.07
  Bottom 0.2: v7.36,148.07 7.36,145.27 11.17,141.46 v11.93,141.46
COL2  (12 unrouted)
COL3  (12 unrouted)
COL4  (12 unrouted)
COL5  (12 unrouted)
COL6  (10 unrouted)
COL7  (10 unrouted)
COL8  (12 unrouted)
COL9  (10 unrouted)
COL10  (10 unrouted)
COL11  (10 unrouted)
COL12  (12 unrouted)
COL13  (12 unrouted)
  Top 0.2: IC3.38 48.46,134.86
COL14  (10 unrouted)
  Top 0.2: IC3.37 48.43,134.1
COL15  (6 unrouted)
COL16  (2 unrouted)
COL17  (12 unrouted)
COL18  (8 unrouted)
COL19  (10 unrouted)
COL20  (8 unrouted)
COL21  (12 unrouted)
COL22  (10 unrouted)
COL23  (12 unrouted)
COL24  (6 unrouted)
COL25  (12 unrouted)
D+32U
  Top 0.2: IC3.5 31.53,139.65 30.73,140.45 19.44,140.45 R3.2
D+USB
  Top 0.2: R3.1 16.71,140.96 15.21,142.45 14.3,142.45 J1.A6 13.83,142.48 J1.B6
D-32U4
  Top 0.2: IC3.4 31.5,140.43 30.98,140.96 21.08,140.96 20.02,142.01 18.17,142.01 18.03,141.86 18.03,139.83 R4.2
D-USB  (via drill 0.35)
  Top 0.2: J1.A7 15.19,141.98 15.62,141.55 v15.62,139.58 15.62,139.57 16.27,138.92 R4.1 | J1.B7 12.25,142.73 v11.96,142.43
  Bottom 0.2: v15.62,139.58 14.98,140.22 14.98,141.21 13.71,141.21 13.46,141.46 12.92,141.46 v11.96,142.43
GND  (via drill 0.35)  (122 unrouted)
  Top 0.152: J1.P1_1 13.8,146.78 13.77,146.74 J1.P1_2
  Top 0.254: J1.A1 14.03,145.23 J1.B12 | J1.B1 14.03,139.23 J1.A12
  Top 0.305: R6.1 14.08,148.5 | J1.B12 13.44,145.59 | J1.B1 13.08,138.4
  Top 0.406: S1.1 13.87,133.44 J1.P2_1 | 34.32,138.86 IC3.6 31.3,138.86 30.47,139.69 28,139.69 26.98,138.67 C8.1 C5.2 | 34.32,138.86 38.67,134.52 IC3.22 38.6,129.07 v38.6,128 38.07,127.47 38.07,127.44 37.43,126.8 Y2.2 | IC3.63 35.52,143.24 | 35.52,143.24 35.52,140.05 | 35.52,140.05 34.32,138.86 | IC3.53 43.39,144.06 39.38,140.05 35.52,140.05 | 35.52,143.24 34.12,143.24 C3.2 | 13.44,145.59 J1.P1_2 | J1.P4 11.07,146.78 J1.P1_1 16.37,146.78 17.29,145.86 R5.2 17.71,144.51 C7.2 27.88,145.41 28.51,146.04 30.22,146.04 31.4,144.86 C3.2 | J1.P4 9.67,148.22 | 13.08,138.4 J1.P2_2 13.51,138.03 J1.P2_1 | J1.P2_1 12.45,136.26 J1.P5 J1.P4 | C3.2 32.27,144.62 | IC3.53 43.39,141.76 v46.22,138.92 | R2.1 v55.11,138.92 | Y2.2 37.35,125.9 C2.2 | C1.2 39.85,124 Y2.4 38.37,122.67 v38.35,122.67 33.46,122.67 C4.2 | Y2.2 37.44,125.82 | R6.1 14,146.98 13.77,146.74 | 45.46,150.1 45.04,149.68 C6.2 44.03,148.78 43.39,148.14 IC3.53
  Bottom 0.406: v46.22,138.92 v55.11,138.92 | v38.6,128 39.11,127.49 42.41,127.49 42.92,126.99 42.92,123.18 42.41,122.67 v38.35,122.67
LED1  (1 unrouted)
  Top 0.2: IC3.15 29.67,131.77
LED2  (1 unrouted)
  Top 0.2: IC3.14 29.35,132.56
LED3  (1 unrouted)
  Top 0.2: IC3.13 29.02,133.35
LED4  (1 unrouted)
  Top 0.2: IC3.12 28.7,134.14
LED5  (1 unrouted)
  Top 0.2: IC3.11 30.59,134.92 30.33,134.67 28.12,134.67
LED6  (1 unrouted)
  Top 0.2: IC3.10 30.76,135.71 30.15,135.1 27.43,135.1
N$1  (2 unrouted)
N$2  (2 unrouted)
N$3  (2 unrouted)
N$4  (2 unrouted)
N$5  (2 unrouted)
N$6  (2 unrouted)
N$7  (2 unrouted)
N$8  (2 unrouted)
N$9  (2 unrouted)
N$10  (2 unrouted)
N$11  (2 unrouted)
N$12  (2 unrouted)
N$13  (2 unrouted)
N$14  (2 unrouted)
N$15  (2 unrouted)
N$16  (2 unrouted)
N$17  (2 unrouted)
N$18  (2 unrouted)
N$19  (2 unrouted)
N$20  (2 unrouted)
N$21  (2 unrouted)
N$22  (2 unrouted)
N$23  (2 unrouted)
N$24  (2 unrouted)
N$25  (2 unrouted)
N$26  (2 unrouted)
N$27  (2 unrouted)
N$28  (2 unrouted)
N$29  (2 unrouted)
N$30  (2 unrouted)
N$31  (2 unrouted)
N$32  (2 unrouted)
N$33  (2 unrouted)
N$34  (2 unrouted)
N$35  (2 unrouted)
N$36  (1 unrouted)
N$37  (2 unrouted)
N$38  (2 unrouted)
N$39  (2 unrouted)
N$40  (2 unrouted)
N$41  (2 unrouted)
N$42  (2 unrouted)
N$43  (2 unrouted)
N$44  (2 unrouted)
N$45  (2 unrouted)
N$46  (2 unrouted)
N$47  (2 unrouted)
N$48  (2 unrouted)
N$49  (2 unrouted)
N$50  (2 unrouted)
N$51  (2 unrouted)
N$52  (2 unrouted)
N$53  (2 unrouted)
N$54  (2 unrouted)
N$55  (2 unrouted)
N$56  (2 unrouted)
N$57  (2 unrouted)
N$58  (2 unrouted)
N$59  (2 unrouted)
N$60  (2 unrouted)
N$61  (2 unrouted)
N$62  (2 unrouted)
N$63  (2 unrouted)
N$64  (2 unrouted)
N$65  (2 unrouted)
N$66  (2 unrouted)
N$67  (2 unrouted)
N$68  (2 unrouted)
N$69  (2 unrouted)
N$70  (2 unrouted)
N$71  (2 unrouted)
N$72  (2 unrouted)
N$73  (2 unrouted)
N$74  (2 unrouted)
N$75  (2 unrouted)
N$76  (2 unrouted)
N$77  (2 unrouted)
N$78  (2 unrouted)
N$79  (1 unrouted)
N$80  (2 unrouted)
N$81  (2 unrouted)
N$82  (2 unrouted)
N$83  (2 unrouted)
N$84  (1 unrouted)
N$85  (2 unrouted)
N$86  (2 unrouted)
N$87  (2 unrouted)
N$88  (2 unrouted)
N$89  (2 unrouted)
N$90  (2 unrouted)
N$91  (2 unrouted)
N$92  (2 unrouted)
N$93  (2 unrouted)
N$94  (2 unrouted)
N$95  (1 unrouted)
N$96  (2 unrouted)
N$97  (2 unrouted)
N$98  (2 unrouted)
N$99  (2 unrouted)
N$100  (2 unrouted)
N$101  (2 unrouted)
N$102  (2 unrouted)
N$103  (2 unrouted)
N$104  (2 unrouted)
N$105  (2 unrouted)
N$106  (2 unrouted)
N$107  (1 unrouted)
N$108  (2 unrouted)
N$109  (2 unrouted)
N$110  (2 unrouted)
N$111  (2 unrouted)
N$112  (2 unrouted)
N$113  (1 unrouted)
N$114  (2 unrouted)
N$115  (2 unrouted)
N$116  (1 unrouted)
N$117  (1 unrouted)
N$118  (1 unrouted)
N$119  (1 unrouted)
N$120  (2 unrouted)
N$121  (1 unrouted)
N$122  (1 unrouted)
N$123  (1 unrouted)
N$124  (1 unrouted)
N$125  (2 unrouted)
N$126  (2 unrouted)
N$127  (2 unrouted)
N$128  (2 unrouted)
N$129  (2 unrouted)
N$130  (2 unrouted)
N$131  (2 unrouted)
N$132  (1 unrouted)
N$133  (1 unrouted)
N$134  (1 unrouted)
N$135  (1 unrouted)
N$136  (1 unrouted)
N$137  (1 unrouted)
N$138  (1 unrouted)
N$139  (1 unrouted)
N$140  (1 unrouted)
N$141  (1 unrouted)
N$142  (1 unrouted)
N$143  (1 unrouted)
N$144  (1 unrouted)
N$145  (1 unrouted)
N$146  (1 unrouted)
N$147  (1 unrouted)
N$149  (1 unrouted)
N$150  (1 unrouted)
N$151  (1 unrouted)
N$152  (1 unrouted)
N$153  (1 unrouted)
N$154  (1 unrouted)
N$155  (1 unrouted)
N$156  (1 unrouted)
N$157  (1 unrouted)
N$158  (1 unrouted)
N$159  (1 unrouted)
N$160  (1 unrouted)
N$161  (1 unrouted)
N$164  (1 unrouted)
N$165  (1 unrouted)
N$166  (1 unrouted)
N$167  (1 unrouted)
N$168  (1 unrouted)
N$169  (1 unrouted)
N$170  (1 unrouted)
N$171  (1 unrouted)
N$172  (1 unrouted)
N$173  (1 unrouted)
N$174  (1 unrouted)
N$175  (1 unrouted)
N$176  (1 unrouted)
N$177  (1 unrouted)
N$178  (1 unrouted)
N$179  (1 unrouted)
N$180  (1 unrouted)
N$181  (1 unrouted)
N$182  (1 unrouted)
N$183  (1 unrouted)
N$184  (1 unrouted)
N$185  (1 unrouted)
N$187  (1 unrouted)
N$188  (1 unrouted)
N$189  (1 unrouted)
N$190  (1 unrouted)
N$191  (1 unrouted)
N$192  (1 unrouted)
N$193  (1 unrouted)
N$194  (1 unrouted)
N$195  (1 unrouted)
N$196  (1 unrouted)
N$197  (1 unrouted)
N$198  (1 unrouted)
N$199  (1 unrouted)
N$200  (1 unrouted)
N$201  (1 unrouted)
N$202  (1 unrouted)
N$203  (1 unrouted)
N$204  (1 unrouted)
N$205  (1 unrouted)
N$206  (1 unrouted)
N$207  (1 unrouted)
N$208  (1 unrouted)
N$209  (1 unrouted)
N$210  (1 unrouted)
N$211  (1 unrouted)
N$212  (1 unrouted)
N$214  (1 unrouted)
N$215  (1 unrouted)
N$216  (1 unrouted)
N$217  (1 unrouted)
N$218  (1 unrouted)
N$219  (1 unrouted)
N$220  (1 unrouted)
N$221  (1 unrouted)
N$222  (1 unrouted)
N$223  (1 unrouted)
N$224  (1 unrouted)
N$225  (1 unrouted)
N$227  (1 unrouted)
N$228  (1 unrouted)
N$229  (1 unrouted)
N$230  (1 unrouted)
N$232  (1 unrouted)
N$233  (1 unrouted)
N$234  (1 unrouted)
N$235  (1 unrouted)
N$238  (1 unrouted)
N$242  (1 unrouted)
N$243  (1 unrouted)
N$245  (1 unrouted)
N$246  (1 unrouted)
N$248  (1 unrouted)
N$249  (1 unrouted)
N$250  (1 unrouted)
N$251  (1 unrouted)
PE2
  Top 0.2: R2.2 48.46,138.92 IC3.43
RESET  (via drill 0.35)  (2 unrouted)
  Top 0.2: IC3.20 37.08,129.12 37.08,128.39 36.19,127.49 v29.71,127.49 29.67,127.49 28.69,126.51 28.69,125.5 29.99,124.2 R1.2 | S1.2 13.96,129.02 17.38,129.02 18.9,127.49
  Bottom 0.2: v29.71,127.49 18.92,127.49
  other vias: 18.89,127.52
ROW1  (24 unrouted)
ROW2  (23 unrouted)
ROW3  (23 unrouted)
ROW4  (18 unrouted)
ROW5  (19 unrouted)
ROW6  (15 unrouted)
UCAP
  Top 0.2: IC3.7 31.33,138.07 30.98,138.42 C8.2
XTAL1
  Top 0.2: C1.1 39.85,125.9 | 39.85,125.9 Y2.1 | 39.85,125.9 39.77,125.99 39.77,126.91 40.24,127.38 IC3.24
XTAL2  (1 unrouted)
  Top 0.2: IC3.23 39.45,127.84 38.35,126.73 38.35,124.95 37.47,124.08 Y2.3 35.63,124.08 | 35.48,124.08 C2.1